# EAGLE schematic Hephaestus (EAGLE 7.3.0)
AUTHOR: Jordan Jones; DOCNUM: 1; ORGANIZATION: CAL POLY IGVC; REV: 1.0.1
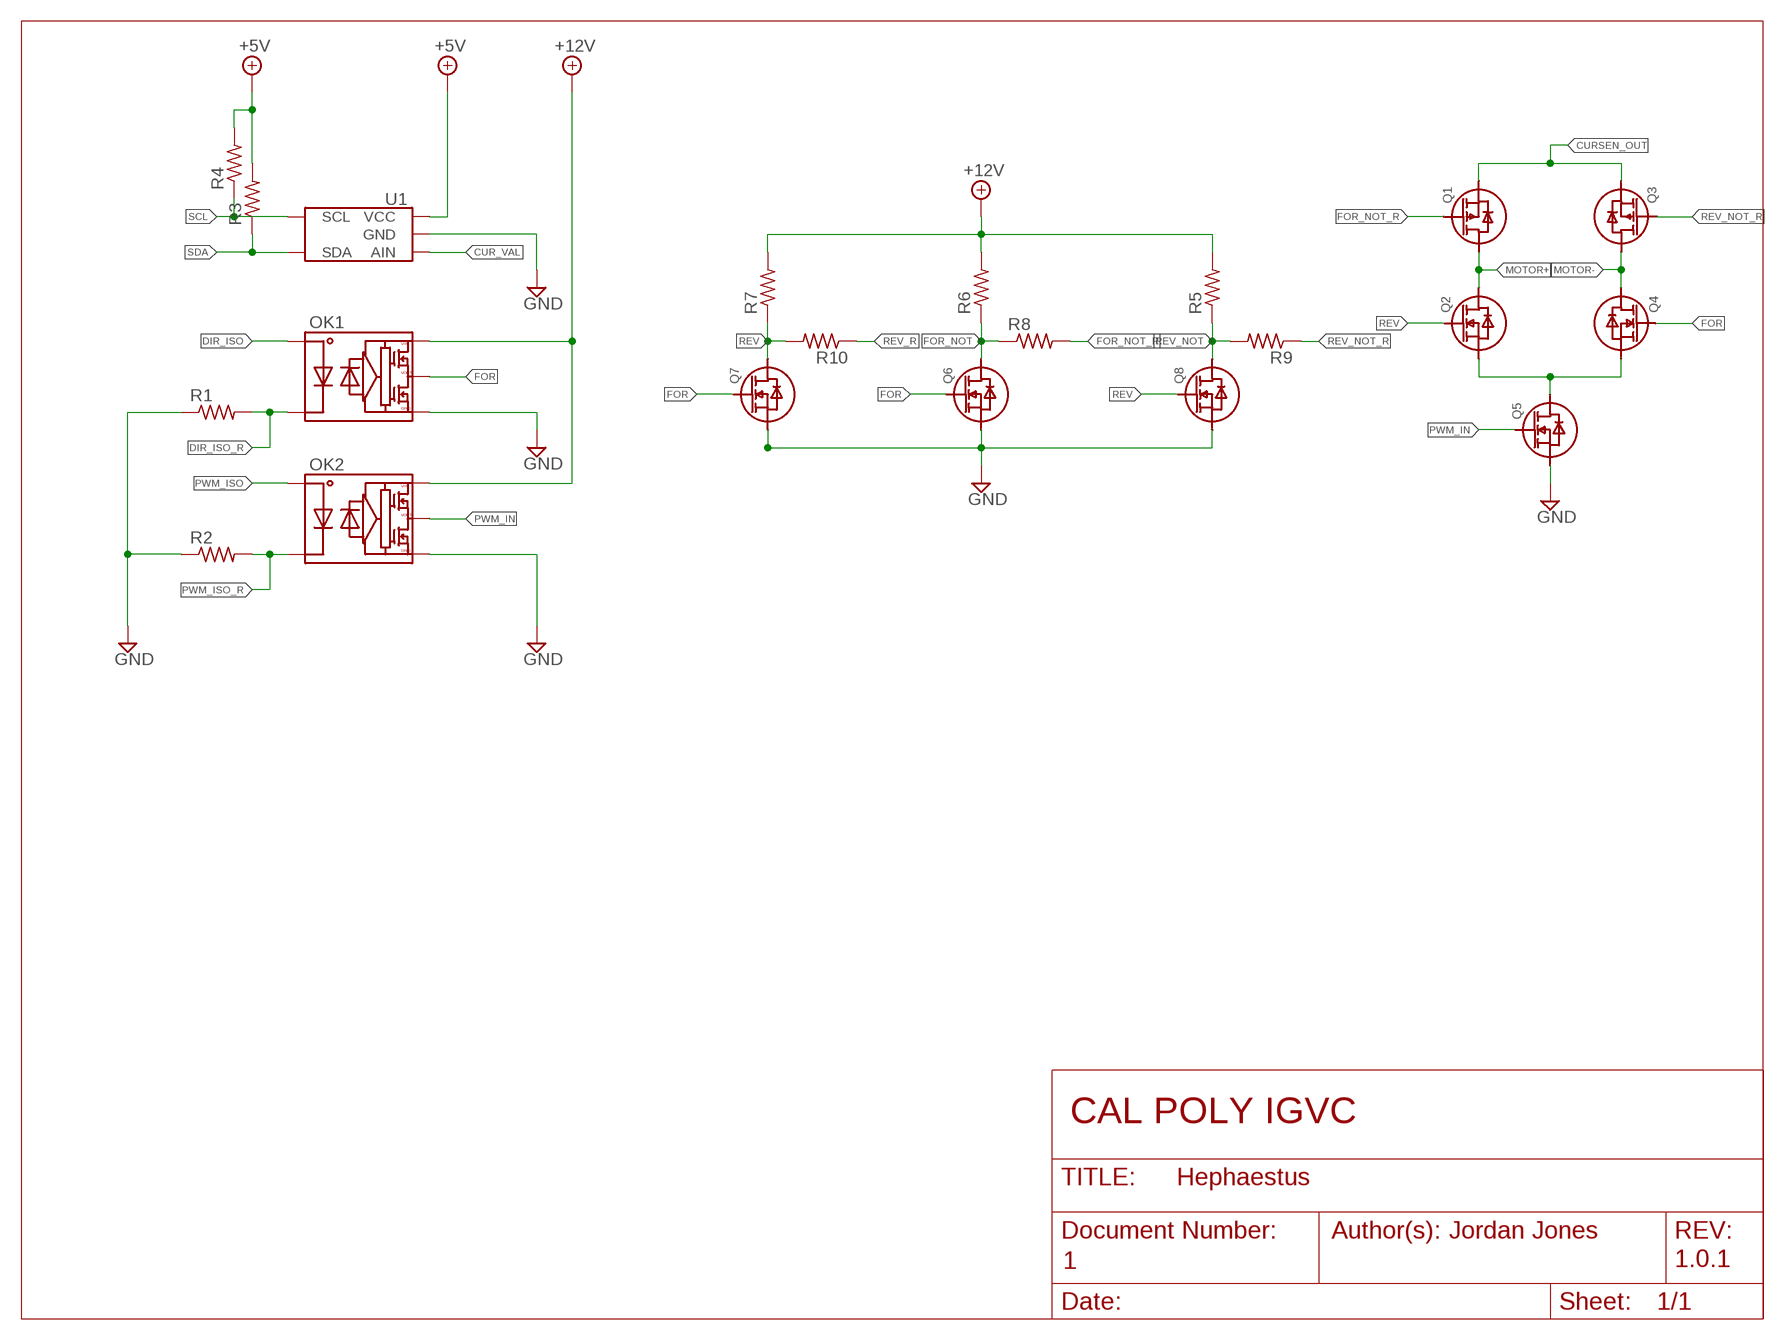
[diagram p0: schematic, sheet 1]

## Parts
OK1  TLP152  [SOIC-6-5]
OK2  TLP152  [SOIC-6-5]
Q1  IPD50P04P413ATMA1  [TO-252-3]
Q2  IPD090N03L_G  [TO-252-3]
Q3  IPD50P04P413ATMA1  [TO-252-3]
Q4  IPD090N03L_G  [TO-252-3]
Q5  IPD090N03L_G  [TO-252-3]
Q6  DMN6140L-7  [SOT-23-3]
Q7  DMN6140L-7  [SOT-23-3]
Q8  DMN6140L-7  [SOT-23-3]
R1  R-US_R0603  [R0603]
R2  R-US_R0603  [R0603]
R3  R-US_R0603  [R0603]
R4  R-US_R0603  [R0603]
R5  R-US_R0603  [R0603]
R6  R-US_R0603  [R0603]
R7  R-US_R0603  [R0603]
R8  R-US_R0603  [R0603]
R9  R-US_R0603  [R0603]
R10  R-US_R0603  [R0603]
U1  MCP3021A0T-E/OT  [SOT-23-5]

## Nets
+5V: R3.2 R4.2 U1.P$1(VCC)
+12V: OK1.P$6 OK2.P$6 R5.2 R6.2 R7.2
CUR_VAL: U1.P$3(AIN)
CURSEN_OUT: Q1.P$2(S) Q3.P$2(S)
DIR_ISO: OK1.P$1
DIR_ISO_R: OK1.P$3 R1.2
FOR: OK1.P$5 Q4.P$1(G) Q6.P$1(G) Q7.P$1(G)
FOR_NOT: Q6.P$3(D) R6.1 R8.1
FOR_NOT_R: Q1.P$1(G) R8.2
GND: OK1.P$4 OK2.P$4 Q5.P$2(S) Q6.P$2(S) Q7.P$2(S) Q8.P$2(S) R1.1 R2.1 U1.P$2(GND)
MOTOR+: Q1.P$3(D) Q2.P$3(D)
MOTOR-: Q3.P$3(D) Q4.P$3(D)
N$5: Q2.P$2(S) Q4.P$2(S) Q5.P$3(D)
PWM_IN: OK2.P$5 Q5.P$1(G)
PWM_ISO: OK2.P$1
PWM_ISO_R: OK2.P$3 R2.2
REV: Q2.P$1(G) Q7.P$3(D) Q8.P$1(G) R7.1 R10.2
REV_NOT: Q8.P$3(D) R5.1 R9.2
REV_NOT_R: Q3.P$1(G) R9.1
REV_R: R10.1
SCL: R4.1 U1.P$6(SCL)
SDA: R3.1 U1.P$4(SDA)

## Library data of the parts
OK1 OK2 = CP-Discrete:TLP152: Optoisolator
Q1 Q3 = CP-Discrete:IPD50P04P413ATMA1: PMOSFET 40V 50A 12.6mOhm @ 10 V 58W
Q2 Q4 Q5 = CP-Discrete:IPD090N03L_G: NMosfet 30V 40A 9mOhm @ 10V 42W
Q6-Q8 = CP-Discrete:DMN6140L-7: NMosfet 60V 1.6A 140mOhm @ 10V 700mW
R1-R10 = resistor:R-US_: RESISTOR, American symbol
U1 = CP-IC:MCP3021A0T-E/OT: Single I2C 10Bit ADC